# Altium schematic sheet BA, BUS MUX.SchDoc: DATAPATHS
size A3; Date: .Date; Author: Jeremy King; CompanyName: King Technologies; DrawnBy: Jeremy King; Engineer: Jeremy King; Organization: King Technologies; Address1: 676 Mandan Ave,; Address2: Melbourne,; Address3: FL,; Address4: 32935; DocumentNumber: 1; Revision: 1; SheetNumber: 3; SheetTotal: 3; ProjectTitle: Siena; Time: .Time
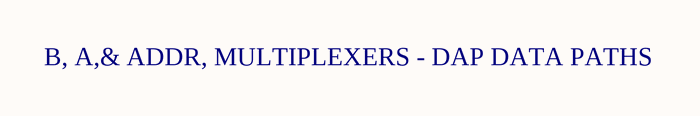
[diagram p0: BA, BUS MUX.SchDoc]

## Notes on the sheet
- B, A,& ADDR, MULTIPLEXERS - DAP DATA PATHS
- Title:
- Author:
- Approved:
- Size:
- Date:
- Git Hash:
- A3
- Prj:
- SW Version:
- Variant:
- Edited:
- CONFIDENTIAL
- File: